# Altium schematic sheet DigitalVoltage_TopSheet.SchDoc
size A4; Author: T. Wendt; CompanyName: Technische Hochschule Nürnberg; Organization: THN ELSYS; Address1: Fürther Straße 250; Address2: 90429 Nürnberg; Address3: GERMANY; SheetNumber: 2; SheetTotal: 3; CompanyName2: Institut ELSYS
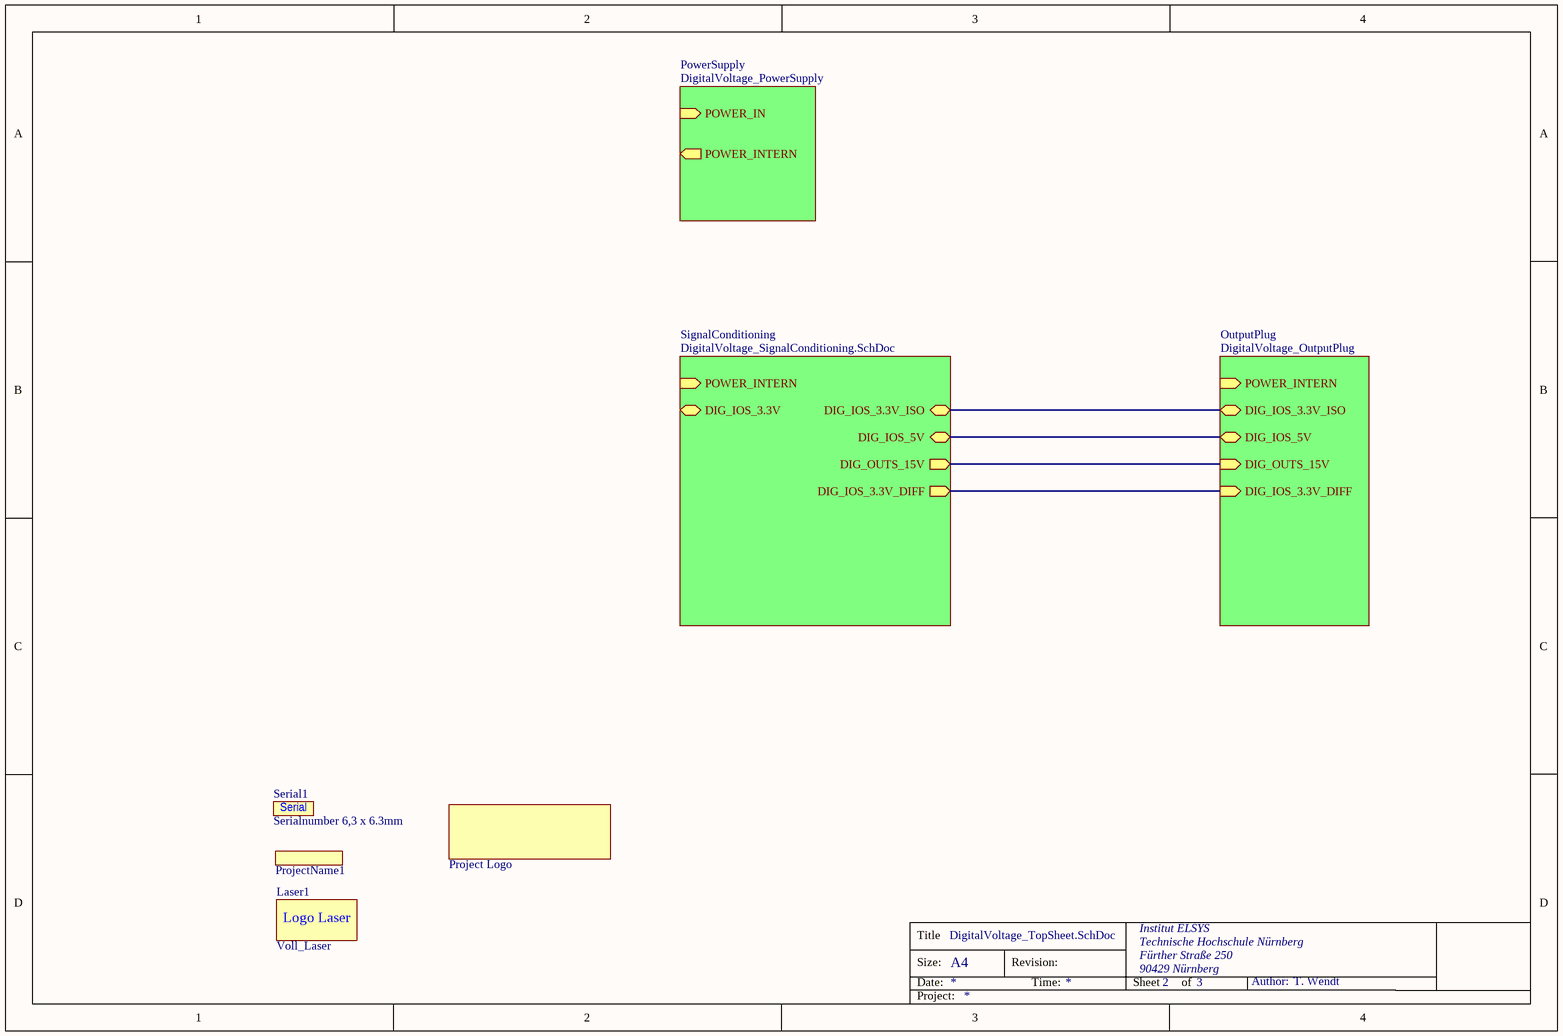
[diagram p0: DigitalVoltage_TopSheet.SchDoc]

## Parts
Laser1  Voll_Laser  [Voll_Laser]
LOGO1  Project Logo  [Logo_Partners_1]  (no BOM)
ProjectName1  Project Name, Rev  [ID_ProjectRev]  (value not drawn)  (no BOM)
Serial1  Serialnumber 6,3 x 6.3mm  [Serial_6.3x6.3mm]  (no BOM)

## Sub-sheets
OutputPlug = DigitalVoltage_OutputPlug: POWER_INTERN (in), DIG_IOS_3.3V_ISO (bidir), DIG_IOS_5V (bidir), DIG_OUTS_15V (in), DIG_IOS_3.3V_DIFF (in)
PowerSupply = DigitalVoltage_PowerSupply: POWER_IN (in), POWER_INTERN (out)
SignalConditioning = DigitalVoltage_SignalConditioning.SchDoc: DIG_IOS_3.3V (bidir), POWER_INTERN (in), DIG_IOS_3.3V_ISO (bidir), DIG_IOS_5V (bidir), DIG_OUTS_15V (out), DIG_IOS_3.3V_DIFF (out)

## Buses and harness runs
bus sheet OutputPlug/DIG_IOS_3.3V_DIFF = sheet SignalConditioning/DIG_IOS_3.3V_DIFF
bus sheet OutputPlug/DIG_IOS_3.3V_ISO = sheet SignalConditioning/DIG_IOS_3.3V_ISO
bus sheet OutputPlug/DIG_IOS_5V = sheet SignalConditioning/DIG_IOS_5V
bus sheet OutputPlug/DIG_OUTS_15V = sheet SignalConditioning/DIG_OUTS_15V

## Notes on the sheet
- Title
- Size:
- Date:
- A4
- Revision:
- Time:
- Sheet
- of
- Author:
- Project:
- (in symbol SerialNumber) Serial
- (in symbol Voll_Laser) Logo Laser

## Library data of the parts
Laser1 = Voll_Laser: Logo Laser Warning Sign
LOGO1 = LOGO PRINT: Created: 2018_09_18_AGeiger; Value: Project Logo
ProjectName1 = ID_ProjectRev: Project Name and Revision Number; Created: 2018_11_23_AGeiger; Value: Project Name, Rev
Serial1 = SerialNumber: Created: 2018_09_18_AGeiger; Value: Serialnumber 6,3 x 6.3mm